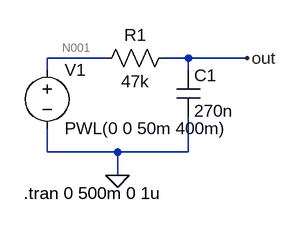
[diagram p0: schematic Draft1.asc]
Draft1.asc, the LTspice schematic file:
Version 4
SHEET 1 880 680
WIRE 80 112 0 112
WIRE 192 112 160 112
WIRE 272 112 192 112
WIRE 0 128 0 112
WIRE 192 128 192 112
WIRE 0 240 0 208
WIRE 96 240 0 240
WIRE 192 240 192 192
WIRE 192 240 96 240
WIRE 96 272 96 240
FLAG 96 272 0
FLAG 272 112 out
SYMBOL res 176 96 R90
WINDOW 0 0 56 VBottom 2
WINDOW 3 32 56 VTop 2
SYMATTR InstName R1
SYMATTR Value 47k
SYMBOL cap 176 128 R0
SYMATTR InstName C1
SYMATTR Value 270n
SYMBOL voltage 0 112 R0
WINDOW 123 0 0 Left 0
WINDOW 39 0 0 Left 0
SYMATTR InstName V1
SYMATTR Value PWL(0 0 50m 400m)
TEXT -32 296 Left 2 !.tran 0 500m 0 1u

The netlist it stands for:
* Draft1.asc
R1 out N001 47k
C1 out 0 270n
V1 N001 0 PWL(0 0 50m 400m)
.tran 0 500m 0 1u
.backanno
.end

* Results of the author's LTspice run, read from the files saved beside the schematic
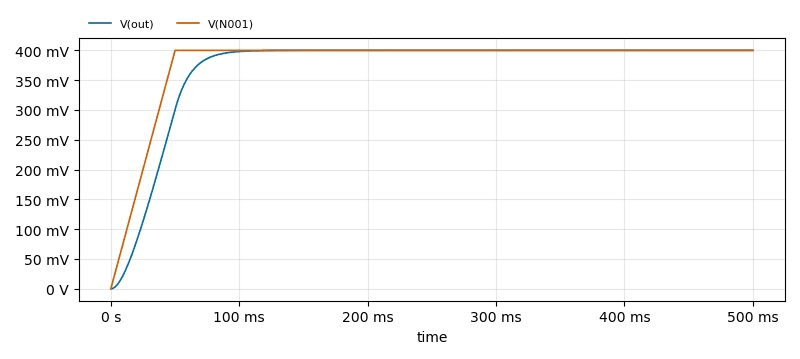
[diagram p1: Transient Analysis of Draft1.asc, plotted from the saved traces]
* Transient Analysis, 1 run:
*   V(out): min 0 V, max 400 mV, average 369.8 mV, rms 380.1 mV, last 400 mV
*   V(N001): min 0 V, max 400 mV, average 380 mV, rms 386.4 mV, last 400 mV